# EAGLE design IOBRMEGA (EAGLE 9.5.1)
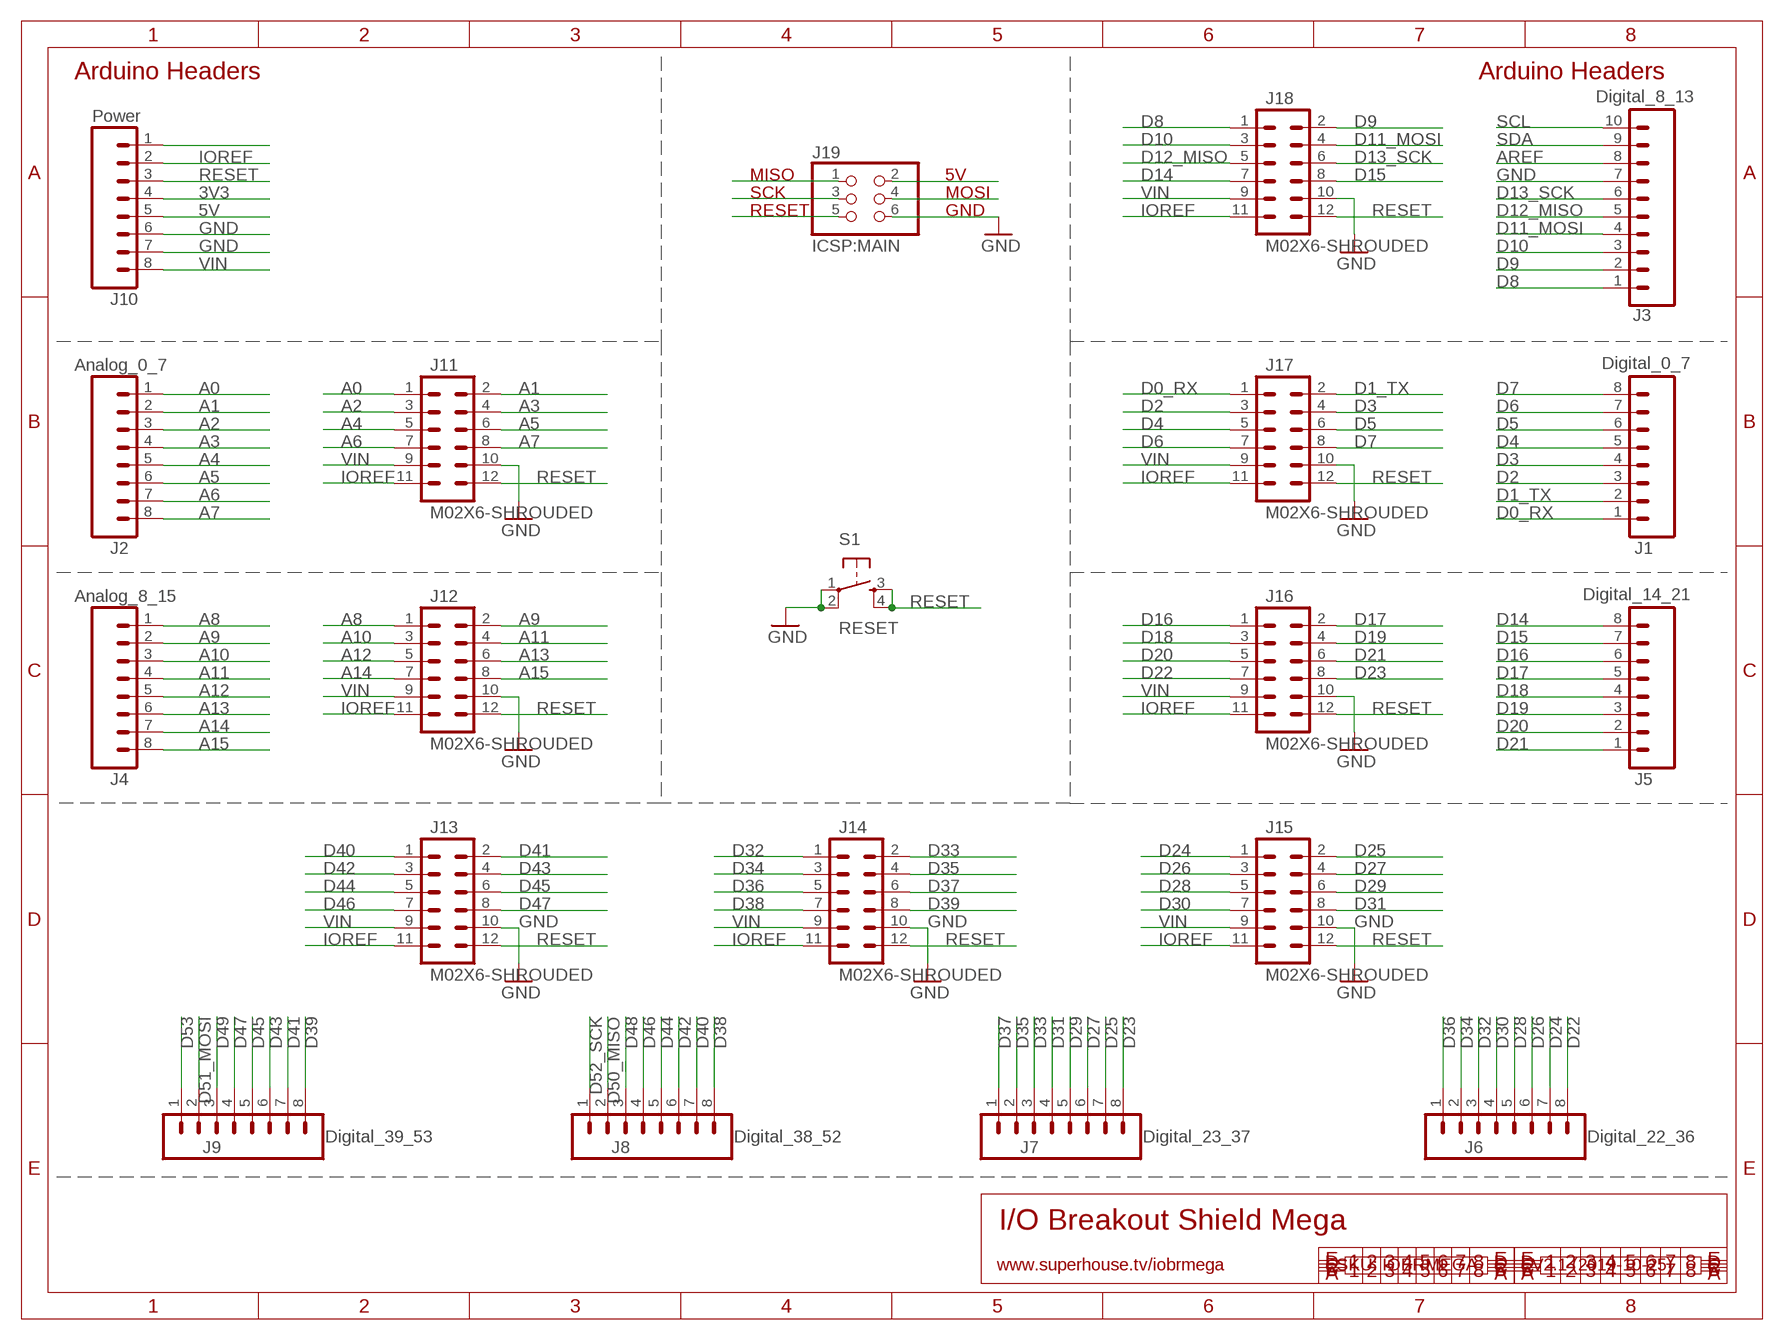
[diagram p0: schematic, sheet 1]

## Parts
J1  Digital_0_7  M08-PIN-BELOW  [1X08-P-BELOW]
J2  Analog_0_7  M08-PIN-BELOW  [1X08-P-BELOW]
J3  Digital_8_13  M10-PIN-BELOW  [1X10-P-BELOW]
J4  Analog_8_15  M08-PIN-BELOW  [1X08-P-BELOW]
J5  Digital_14_21  M08-PIN-BELOW  [1X08-P-BELOW]
J6  Digital_22_36  M08-PIN-BELOW  [1X08-P-BELOW]
J7  Digital_23_37  M08-PIN-BELOW  [1X08-P-BELOW]
J8  Digital_38_52  M08-PIN-BELOW  [1X08-P-BELOW]
J9  Digital_39_53  M08-PIN-BELOW  [1X08-P-BELOW]
J10  Power  M08-PIN-BELOW  [1X08-P-BELOW]
J11  M02X6-SHROUDED  [2X06-SHROUDED]
J12  M02X6-SHROUDED  [2X06-SHROUDED]
J13  M02X6-SHROUDED  [2X06-SHROUDED]
J14  M02X6-SHROUDED  [2X06-SHROUDED]
J15  M02X6-SHROUDED  [2X06-SHROUDED]
J16  M02X6-SHROUDED  [2X06-SHROUDED]
J17  M02X6-SHROUDED  [2X06-SHROUDED]
J18  M02X6-SHROUDED  [2X06-SHROUDED]
J19  ICSP:MAIN  PINHD-2X3  [2X03]
S1  RESET  TAC_SWITCH-PTH-6  [TACTILE-PTH-6MM]

## Nets
3V3: J10.4
5V: J10.5
A0: J2.1 J11.1
A1: J2.2 J11.2
A2: J2.3 J11.3
A3: J2.4 J11.4
A4: J2.5 J11.5
A5: J2.6 J11.6
A6: J2.7 J11.7
A7: J2.8 J11.8
A8: J4.1 J12.1
A9: J4.2 J12.2
A10: J4.3 J12.3
A11: J4.4 J12.4
A12: J4.5 J12.5
A13: J4.6 J12.6
A14: J4.7 J12.7
A15: J4.8 J12.8
AREF: J3.8
D0_RX: J1.1 J17.1
D1_TX: J1.2 J17.2
D2: J1.3 J17.3
D3: J1.4 J17.4
D4: J1.5 J17.5
D5: J1.6 J17.6
D6: J1.7 J17.7
D7: J1.8 J17.8
D8: J3.1 J18.1
D9: J3.2 J18.2
D10: J3.3 J18.3
D11_MOSI: J3.4 J18.4
D12_MISO: J3.5 J18.5
D13_SCK: J3.6 J18.6
D14: J5.8 J18.7
D15: J5.7 J18.8
D16: J5.6 J16.1
D17: J5.5 J16.2
D18: J5.4 J16.3
D19: J5.3 J16.4
D20: J5.2 J16.5
D21: J5.1 J16.6
D22: J6.8 J16.7
D23: J7.8 J16.8
D24: J6.7 J15.1
D25: J7.7 J15.2
D26: J6.6 J15.3
D27: J7.6 J15.4
D28: J6.5 J15.5
D29: J7.5 J15.6
D30: J6.4 J15.7
D31: J7.4 J15.8
D32: J6.3 J14.1
D33: J7.3 J14.2
D34: J6.2 J14.3
D35: J7.2 J14.4
D36: J6.1 J14.5
D37: J7.1 J14.6
D38: J8.8 J14.7
D39: J9.8 J14.8
D40: J8.7 J13.1
D41: J9.7 J13.2
D42: J8.6 J13.3
D43: J9.6 J13.4
D44: J8.5 J13.5
D45: J9.5 J13.6
D46: J8.4 J13.7
D47: J9.4 J13.8
D48: J8.3
D49: J9.3
D50_MISO: J8.2
D51_MOSI: J9.2
D52_SCK: J8.1
D53: J9.1
GND: J3.7 J10.6 J10.7 J11.10 J12.10 J13.10 J14.10 J15.10 J16.10 J17.10 J18.10 J19.6 S1.1 S1.2
IOREF: J10.2 J11.11 J12.11 J13.11 J14.11 J15.11 J16.11 J17.11 J18.11
N$186: J19.1
N$187: J19.3
N$188: J19.5
N$197: J19.2
N$198: J19.4
N$314: J10.1
RESET: J10.3 J11.12 J12.12 J13.12 J14.12 J15.12 J16.12 J17.12 J18.12 S1.3 S1.4
SCL: J3.10
SDA: J3.9
VIN: J10.8 J11.9 J12.9 J13.9 J14.9 J15.9 J16.9 J17.9 J18.9

## Notes on the sheet
- Arduino Headers | Arduino Headers
- MISO | 5V
- SCK | MOSI
- RESET | GND
- I/O Breakout Shield Mega
- www.superhouse.tv/iobrmega | SKU: IOBRMEGA | V2.1 (2019-10-25)

## Library data of the parts
J1 J2 J4-J10 = SuperHouse-Connectors:M08: 8-way header Standard 1x8 header, and screw terminal variations
J3 = SuperHouse-Connectors:M10: 10-way header Standard 1x10 header, and screw terminal variations
J11-J18 = SuperHouse-Connectors:M02X6: M12 header in 2x6 format
J19 = pinhead:PINHD-2X3: PIN HEADER
S1 = SuperHouse-Switches:TAC_SWITCH: Momentary Switch Tactile switch, normally-open.

## Board
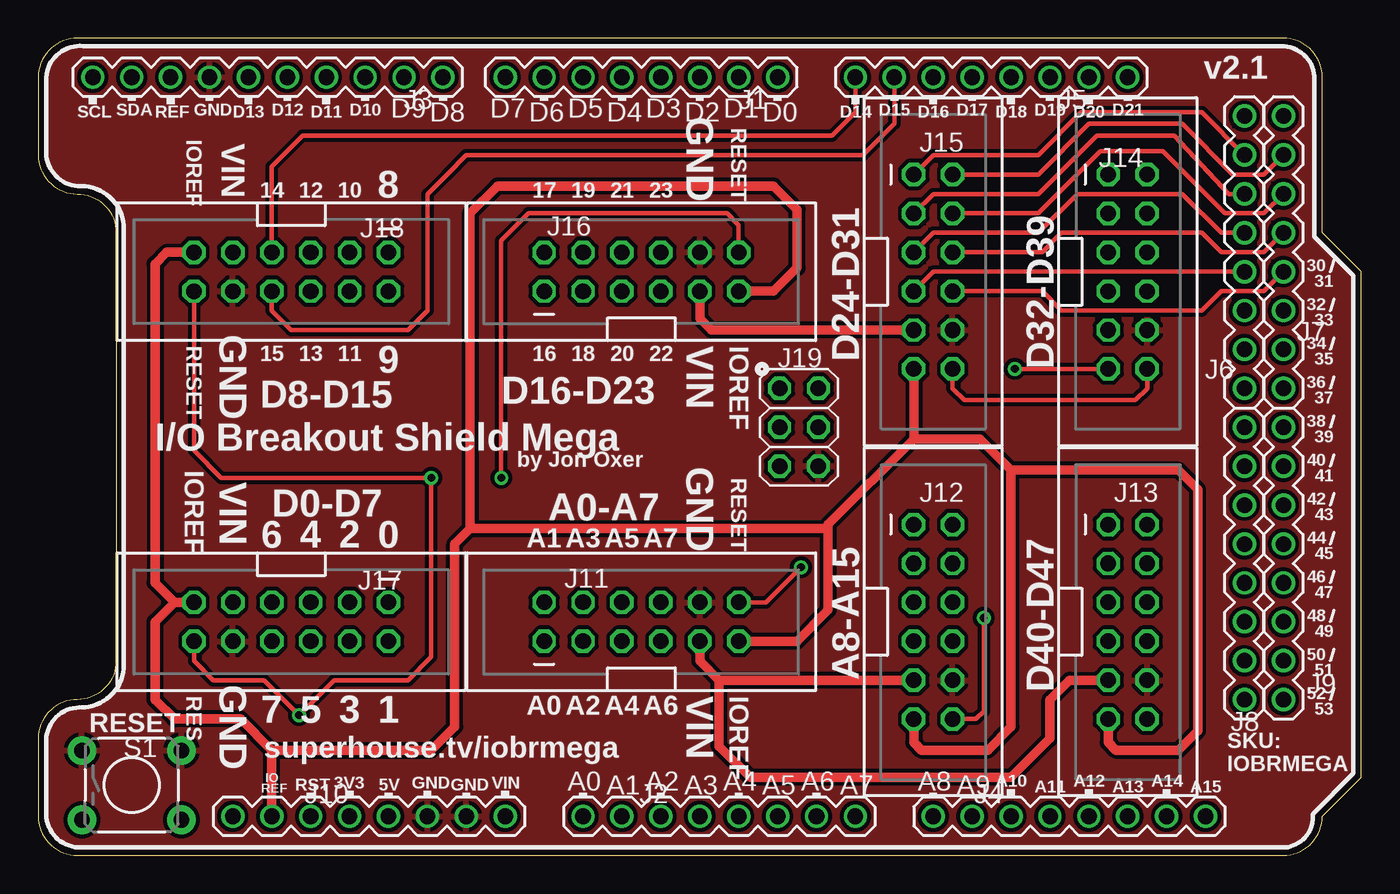
[diagram p1: board, top side]
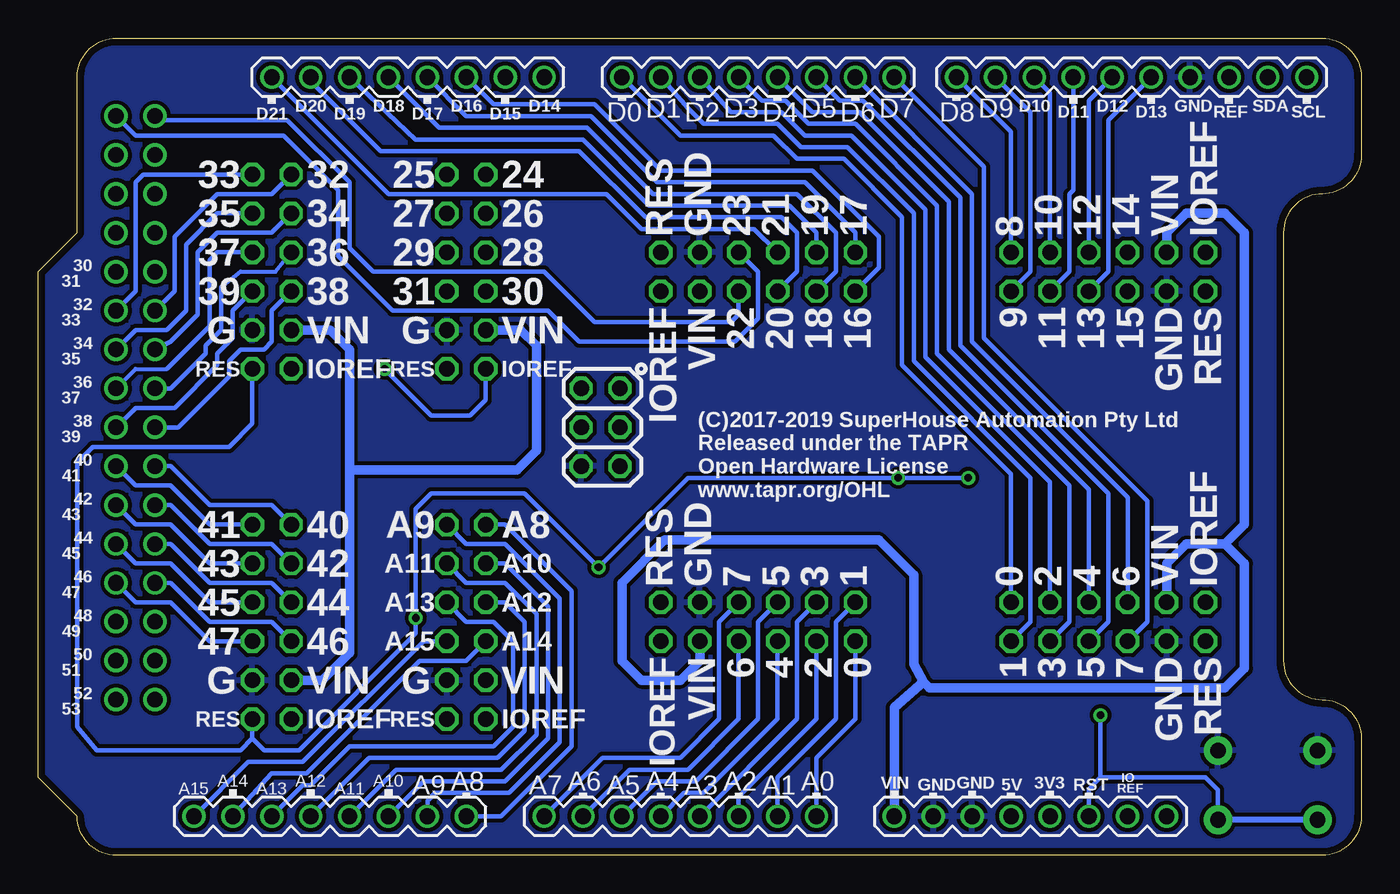
[diagram p2: board, bottom side, seen from below]

Size 86.36 x 53.34 mm. Coordinates in mm from the lower left corner, seen from the top.
Outline: 0,2.54 arc90 2.54,0 81.28,0 arc90 83.82,2.54 86.36,5.08 86.36,38.1 83.82,40.64 83.82,50.8 arc90 81.28,53.34 2.54,53.34 arc90 0,50.8 0,45.72 arc90 2.54,43.18 arc-90 5.08,40.64 5.08,12.7 arc-90 2.54,10.16 arc90 0,7.62 0,2.54
Copper layers (1*16): Top 0.035mm / dielectric 1.5mm / Bottom 0.035mm
Design rules "default *": minimum track width 10mil, minimum drill 24mil, track to track 10mil, track to pad 10mil, pad to pad 10mil, via to via 10mil, smd to smd 8mil, copper to edge 18mil, drill to drill 8mil, minimum pad ring 10mil, minimum via ring 8mil, stop-mask expansion 4mil, vias tented up to drill 0mil, thermal gap 10mil

### Footprints (pad centres in the part's own frame; a part is rotated, then mirrored left to right if it is on the bottom)
1X08-P-BELOW = drill 1.016: 1 0,0; 2 2.54,0; 3 5.08,0; 4 7.62,0; 5 10.16,0; 6 12.7,0; 7 15.24,0; 8 17.78,0
1X10-P-BELOW = drill 1.016: 1 0,0; 2 2.54,0; 3 5.08,0; 4 7.62,0; 5 10.16,0; 6 12.7,0; 7 15.24,0; 8 17.78,0; 9 20.32,0; 10 22.86,0
2X06-SHROUDED = drill 1.016 octagon: 1 0,0; 2 2.54,0; 3 0,-2.54; 4 2.54,-2.54; 5 0,-5.08; 6 2.54,-5.08; 7 0,-7.62; 8 2.54,-7.62; 9 0,-10.16; 10 2.54,-10.16; 11 0,-12.7; 12 2.54,-12.7
2X03 = drill 1.016 octagon: 1 -2.54,-1.27; 2 -2.54,1.27; 3 0,-1.27; 4 0,1.27; 5 2.54,-1.27; 6 2.54,1.27
TACTILE-PTH-6MM = drill 1.016 pad 1.88: 1 -3.251,2.261; 2 3.251,2.261; 3 -3.251,-2.261; 4 3.251,-2.261

### Placement (x,y rotation side)
J1  48.26,50.8 180 top
J2  35.56,2.54 0 top
J3  26.42,50.8 180 top
J4  58.42,2.54 0 top
J5  71.12,50.8 180 top
J6  78.74,30.48 90 top
J7  81.28,30.48 90 top
J8  78.74,10.16 90 top
J9  81.28,10.16 90 top
J10  12.7,2.54 0 top
J11  33.02,13.97 90 top
J12  57.15,21.59 0 top
J13  69.85,21.59 0 top
J14  69.85,44.45 0 top
J15  57.15,44.45 0 top
J16  33.02,36.83 90 top
J17  22.86,16.51 270 top
J18  22.86,39.37 270 top
J19  49.66,27.94 270 top
S1  6.1,4.57 0 top

### Tracks (layer width: path | path; a pad name or v marks a point on that pad's centre or on a via)
A0
  Bottom 0.305: J2.1 35.56,6.35 33.02,8.89 J11.1
A1
  Bottom 0.305: J11.2 34.29,15.24 34.29,8.89 38.1,5.08 J2.2
A2
  Bottom 0.305: J11.3 35.56,8.89 40.64,3.81 J2.3
A3
  Bottom 0.305: J11.4 36.83,15.24 36.83,8.89 J2.4
A4
  Bottom 0.305: J11.5 38.1,8.89 42.93,4.06 44.2,4.06 J2.5
A5
  Bottom 0.305: J11.6 39.37,15.24 39.37,8.89 43.43,4.83 45.97,4.83 J2.6
A6
  Bottom 0.305: J2.7 47.75,5.59 43.94,5.59 40.64,8.89 J11.7
A7
  Bottom 0.305: J11.8 41.91,15.24 41.91,8.89 44.45,6.35 49.53,6.35 J2.8
A8
  Bottom 0.305: J4.1 56.13,2.54 51.56,7.11 51.56,17.27 55.88,21.59 J12.1
A9
  Bottom 0.305: J4.2 60.96,3.56 60.45,4.06 55.63,4.06 52.32,7.37 52.32,16.76 55.88,20.32 58.42,20.32 J12.2
A10
  Bottom 0.305: J4.3 61.21,4.83 55.88,4.83 53.09,7.62 53.09,16.26 55.88,19.05 J12.3
A11
  Bottom 0.305: J4.4 62.99,5.59 56.13,5.59 53.85,7.87 53.85,15.75 55.88,17.78 58.42,17.78 J12.4
A12
  Bottom 0.305: J4.5 64.77,6.35 56.39,6.35 54.61,8.13 54.61,15.24 55.88,16.51 J12.5
A13
  Bottom 0.305: J12.6 58.42,15.24 56.64,15.24 55.37,13.97 55.37,8.38 56.64,7.11 66.04,7.11 68.58,4.57 69.09,4.57 J4.6
A14
  Bottom 0.305: J4.7 71.12,5.33 68.83,5.33 61.47,12.7 58.42,12.7 J12.7
A15
  Bottom 0.305: J4.8 72.64,6.1 69.09,6.1 61.21,13.97 J12.8
D0_RX
  Bottom 0.305: J17.1 22.86,24.89 29.97,32 29.97,41.66 33.78,45.47 36.83,45.47 38.35,46.99 44.45,46.99 J1.1
D1_TX
  Bottom 0.305: J17.2 21.59,15.24 21.59,24.64 29.21,32.26 29.21,41.91 33.53,46.23 36.58,46.23 38.1,47.75 42.93,47.75 43.94,48.77 J1.2
D2
  Bottom 0.305: J17.3 20.32,24.38 28.45,32.51 28.45,42.16 33.27,46.99 36.32,46.99 37.85,48.51 41.15,48.51 J1.3
D3
  Bottom 0.305: J17.4 19.05,15.24 19.05,24.13 27.69,32.77 27.69,42.42 33.02,47.75 36.07,47.75 37.59,49.28 39.12,49.28 J1.4
D4
  Bottom 0.305: J17.5 17.78,23.88 26.92,33.02 26.92,42.67 32.77,48.51 35.81,48.51 J1.5
D5
  Bottom 0.305: J17.6 16.51,15.24 16.51,23.62 26.16,33.27 26.16,42.93 32.51,49.28 34.04,49.28 J1.6
D6
  Bottom 0.305: J17.7 15.24,23.37 25.4,33.53 25.4,43.18 J1.7
D7
  Bottom 0.305: J17.8 13.97,15.24 13.97,23.11 24.64,33.78 24.64,44.96 J1.8
D8
  Bottom 0.305: J18.1 22.86,47.24 J3.1
D9
  Bottom 0.305: J18.2 21.59,38.1 21.59,48.51 J3.2
D10
  Bottom 0.305: J18.3 20.32,49.78 J3.3
D11_MOSI
  Bottom 0.305: J18.4 19.05,38.1 19.05,43.18 18.8,43.43 J3.4
D12_MISO
  Bottom 0.305: J18.5 17.78,49.28 J3.5
D13_SCK
  Bottom 0.305: J18.6 16.51,38.1 16.51,48.01 J3.6
D14
  Top 0.305: J18.7 15.24,44.96 17.27,46.99 49.53,46.99 51.82,46.99 53.34,48.51 J5.8
D15
  Top 0.305: J5.7 55.88,47.75 53.85,45.72 50.8,45.72 27.94,45.72 26.67,44.45 25.4,43.18 25.4,35.56 24.13,34.29 16.51,34.29 15.24,35.56 J18.8
D16
  Bottom 0.305: J16.1 31.5,38.35 31.5,40.39 35.81,44.7 45.72,44.7 50.04,49.02 56.64,49.02 J5.6
D17
  Bottom 0.305: J5.5 58.42,48.26 50.29,48.26 45.97,43.94 36.32,43.94 33.02,40.64 J16.2
D18
  Bottom 0.305: J16.3 34.29,38.1 34.29,40.64 36.83,43.18 46.23,43.18 50.55,47.5 60.2,47.5 J5.4
D19
  Bottom 0.305: J5.3 61.72,46.74 50.8,46.74 46.48,42.42 37.34,42.42 35.56,40.64 J16.4
D20
  Bottom 0.305: J16.5 36.83,38.1 36.83,40.64 37.85,41.66 46.74,41.66 51.05,45.97 64.01,45.97 68.58,50.55 J5.2
D21
  Bottom 0.305: J16.6 39.62,40.89 46.99,40.89 49.28,43.18 63.5,43.18 J5.1
D22
  Bottom 0.254: 78.49,48.01 J6.8
  Bottom 0.305: 78.49,48.01 70.1,48.01 66.04,43.94 66.04,39.62 64.52,38.1 53.34,38.1 50.04,34.8 41.15,34.8 40.64,35.31 J16.7
D23
  Bottom 0.305: J16.8 39.37,38.1 39.37,35.05 40.89,33.53 51.05,33.53 53.09,35.56 63.25,35.56 66.8,39.12 66.8,43.43 70.36,46.99 80.01,46.99 J7.8
D24
  Top 0.305: J6.7 75.95,48.51 68.07,48.51 65.28,45.72 58.42,45.72 J15.1
D25
  Top 0.305: J7.7 80.01,44.45 77.98,44.45 74.68,47.75 68.58,47.75 65.28,44.45 J15.2
D26
  Top 0.305: J6.6 77.72,43.18 74.17,46.99 69.09,46.99 65.28,43.18 58.42,43.18 J15.3
D27
  Top 0.305: J7.6 80.01,41.91 77.47,41.91 73.41,45.97 69.34,45.97 65.28,41.91 J15.4
D28
  Top 0.305: J15.5 58.42,40.64 65.28,40.64 67.82,43.18 74.68,43.18 77.22,40.64 J6.5
D29
  Top 0.305: J7.5 80.01,39.37 77.22,39.37 75.95,40.64 66.8,40.64 65.53,39.37 J15.6
D30
  Top 0.305: J6.4 58.42,38.1 J15.7
D31
  Top 0.305: J7.4 80.01,36.83 77.22,36.83 75.95,35.56 66.8,35.56 65.53,36.83 J15.8
D32
  Bottom 0.305: J6.3 77.47,36.83 77.47,40.39 74.68,43.18 71.12,43.18 J14.1
D33
  Bottom 0.305: J7.3 80.01,36.83 80.01,43.94 79.5,44.45 J14.2
D34
  Bottom 0.305: J14.3 71.12,40.64 74.68,40.64 75.95,39.37 75.95,35.31 77.72,33.53 J6.2
D35
  Bottom 0.305: J14.4 74.68,41.91 76.71,39.88 76.71,35.56 77.98,34.29 80.01,34.29 J7.2
D36
  Bottom 0.254: J6.1 78.49,30.48 | 73.15,38.1 70.87,38.1 J14.5
  Bottom 0.305: 78.49,30.48 77.72,30.48 75.44,32.77 75.44,33.27 74.42,34.29 74.42,37.08 73.15,38.1
D37
  Bottom 0.254: J7.1 80.01,31.75 77.98,31.75
  Bottom 0.305: 77.98,31.75 75.18,34.54 75.18,38.86 74.68,39.37 J14.6
D38
  Bottom 0.305: J8.8 77.22,27.94 73.91,31.24 73.91,32.26 73.15,33.02 71.63,33.02 71.12,33.53 71.12,35.56 J14.7
D39
  Bottom 0.305: J9.8 80.01,29.21 77.47,29.21 74.68,32 74.68,32.77 73.66,33.78 73.66,35.56 J14.8
D40
  Bottom 0.305: J8.7 77.72,25.4 75.18,22.86 71.12,22.86 J13.1
D41
  Bottom 0.305: J9.7 80.01,24.13 77.72,24.13 75.18,21.59 J13.2
D42
  Bottom 0.305: J8.6 77.72,22.86 75.18,20.32 71.12,20.32 J13.3
D43
  Bottom 0.305: J9.6 80.01,21.59 77.72,21.59 75.18,19.05 J13.4
D44
  Bottom 0.305: J8.5 77.72,20.32 75.18,17.78 71.12,17.78 J13.5
D45
  Bottom 0.305: J9.5 80.01,19.05 77.72,19.05 75.18,16.51 J13.6
D46
  Bottom 0.305: J8.4 77.72,17.78 75.18,15.24 71.12,15.24 J13.7
D47
  Bottom 0.305: J9.4 80.01,16.51 77.72,16.51 75.18,13.97 J13.8
GND
  pour Bottom: 0,50.8 arc-74 2.54,53.34 81.28,53.34 arc-74 83.82,50.8 83.82,40.64 86.36,38.1 86.36,5.08 83.82,2.54 arc-74 81.28,0 1.27,0 arc-74 0,2.54 0,7.62 arc-90 2.54,10.16 arc90 5.08,12.7 5.08,40.64 arc90 2.54,43.18 arc-90 0,45.72
  pour Top: 0,50.8 arc-74 2.54,53.34 81.28,53.34 arc-74 83.82,50.8 83.82,40.64 86.36,38.1 86.36,5.08 83.82,2.54 arc-74 81.28,0 1.27,0 arc-74 0,2.54 0,7.62 arc-90 2.54,10.16 arc90 5.08,12.7 5.08,40.64 arc90 2.54,43.18 arc-90 0,45.72
IOREF  (via drill 0.5)
  Top 0.305: v63.75,31.75 J14.11
  Top 0.61: J10.2 15.24,6.86 | 15.24,6.86 13.21,8.89 8.89,8.89 7.62,10.16 7.62,15.24 8.89,16.51 | J15.11 57.15,27.18 | 57.15,27.18 51.56,21.59 51.56,21.34 | 51.56,21.34 51.56,16 49.53,13.97 J11.11 | 15.24,6.86 25.65,6.86 27.18,8.38 27.18,20.32 28.19,21.34 | 28.19,21.34 51.56,21.34 | J12.11 57.15,7.37 57.66,6.86 61.98,6.86 63.5,8.38 63.5,25.15 | 63.5,25.15 61.47,27.18 57.15,27.18 | J13.11 69.85,7.37 70.36,6.86 74.42,6.86 75.69,8.13 75.69,23.88 74.42,25.15 63.5,25.15 | J16.11 48.01,36.83 49.53,38.35 49.53,42.16 48.01,43.69 29.97,43.69 28.19,41.91 28.19,21.34 | J18.11 8.38,39.37 7.62,38.61 7.62,17.78 8.89,16.51 | 8.89,16.51 J17.11
  Bottom 0.305: v63.75,31.75 60.71,28.7 58.17,28.7 57.15,29.72 J15.11
RESET  (via drill 0.5)
  Top 0.305: v61.72,15.49 61.72,9.4 61.21,8.89 J12.12 | J11.12 47.5,16.51 v49.78,18.8 | J16.12 45.72,41.15 44.96,41.91 32,41.91 30.23,40.13 v30.23,24.64 | J14.12 72.39,30.48 71.63,29.72 60.45,29.72 59.69,30.48 J15.12 | J18.12 10.16,26.42 11.94,24.64 v25.65,24.64 25.65,12.95 24.13,11.43 19.3,11.43 v17.02,9.14 14.73,11.43 11.43,11.43 10.16,12.7 J17.12
  Bottom 0.305: S1.4 9.35,4.27 10.16,5.08 17.02,5.08 | 17.02,5.08 17.78,4.32 J10.3 | v17.02,9.14 17.02,5.08 | J14.12 72.39,28.19 73.91,26.67 82.8,26.67 83.82,25.65 83.82,8.38 82.55,6.86 73.15,6.86 72.39,7.62 | J13.12 72.39,7.62 | 72.39,7.62 71.63,6.86 69.34,6.86 61.72,14.48 v61.72,15.49 61.72,22.61 60.71,23.62 54.61,23.62 v49.78,18.8 43.94,24.64 v30.23,24.64 v25.65,24.64
  Bottom 0.406: S1.3 S1.4
VIN
  Top 0.61: J12.9 44.45,11.43 | J15.9 43.94,34.29 43.18,35.05 J16.9 | 44.45,11.43 44.45,7.11 46.48,5.08 63.5,5.08 66.04,7.62 66.04,10.16 67.31,11.43 J13.9 | 44.45,11.43 43.18,12.7 J11.9
  Bottom 0.61: J13.9 67.82,11.43 66.04,13.21 66.04,25.15 | 66.04,25.15 66.04,33.02 67.31,34.29 J14.9 | 28.57,11.3 29.21,12.45 29.21,18.29 31.5,20.57 45.47,20.57 48.26,17.78 48.26,12.7 46.99,11.43 44.45,11.43 43.18,12.7 J11.9 | 28.57,11.3 28.19,10.92 8.89,10.92 7.62,12.19 7.62,19.05 8.89,20.32 | J18.9 12.7,40.64 11.43,41.91 8.89,41.91 7.62,40.64 7.62,21.59 8.89,20.32 | J17.9 12.7,19.05 11.43,20.32 8.89,20.32 | J15.9 54.86,34.29 53.85,33.27 53.85,26.42 55.12,25.15 66.04,25.15 | J10.8 30.48,9.65 28.57,11.3

### Text on the board
tPlace: v2.1 | SCL | SDA | REF | GND | D13 | D12 | D11 | D10 | D9 | D8 | D7 | D6 | D5 | D4 | D3 | D2 | D1 | D0 | D14 | D15 | D16 | D17 | D18 | D19 | D20 | D21 | IOREF | VIN | 14 | 12 | 10 | 8 | 17 | 19 | 21 | 23 | GND | RESET | 30 | 31 | 32 | 33 | RESET | VIN | IOREF | 34 | 15 | 13 | 11 | 16 | 18 | 20 | 22 | D24-D31 | D32-D39 | 35 | 9 | 36 | D8-D15 | D16-D23 | 37 | GND | 38 | 39 | I/O Breakout Shield Mega | IOREF | by Jon Oxer | 40 | VIN | 41 | 42 | D0-D7 | A0-A7 | 43 | 6 | 4 | 2 | 0 | A1 | A3 | A5 | A7 | GND | RESET | 44 | 45 | 46 | 47 | 48 | 49 | 50 | 51 | A8-A15 | D40-D47 | RES | VIN | IOREF | 52 | 7 | 5 | 3 | 1 | A0 | A2 | A4 | A6 | 53 | RESET | GND | superhouse.tv/iobrmega | IO | SKU: / IOBRMEGA | REF | RST | 3V3 | 5V | GND | GND | VIN | A0 | A1 | A2 | A3 | A4 | A5 | A6 | A7 | A8 | A9 | A10 | A11 | A12 | A13 | A14 | A15
bPlace: SDA | GND | D12 | D10 | D14 | D16 | D18 | D20 | SCL | REF | D13 | D11 | D9 | D8 | D7 | D6 | D5 | D4 | D3 | D2 | D1 | D0 | D15 | D17 | D19 | D21 | 24 | 25 | 32 | 33 | 26 | 27 | 34 | 35 | IOREF | VIN | 14 | 12 | 10 | 8 | 17 | 19 | 21 | 23 | GND | RES | 28 | 29 | 36 | 37 | 30 | 30 | 31 | 38 | 39 | 31 | RES | GND | 15 | 13 | 11 | 9 | 16 | 18 | 20 | 22 | VIN | IOREF | 32 | 33 | VIN | G | VIN | G | 34 | IOREF | RES | IOREF | RES | 35 | 36 | 37 | 38 | 39 | 40 | 41 | (C)2017-2019 SuperHouse Automation Pty Ltd / Released under the TAPR / Open Hardware License / www.tapr.org/OHL | 42 | A8 | A9 | 40 | 41 | 43 | 44 | A10 | A11 | 42 | 43 | 45 | IOREF | VIN | 6 | 4 | 2 | 0 | 1 | 3 | 5 | 7 | GND | RES | 46 | A12 | A13 | 44 | 45 | 47 | 48 | A14 | A15 | 46 | 47 | 49 | RES | GND | 7 | 5 | 3 | 1 | 0 | 2 | 4 | 6 | VIN | IOREF | 50 | 51 | VIN | G | VIN | G | 52 | IOREF | RES | IOREF | RES | 53 | IO | REF | RST | 3V3 | 5V | GND | GND | VIN | A0 | A1 | A2 | A3 | A4 | A5 | A6 | A7 | A8 | A9 | A10 | A11 | A12 | A13 | A14 | A15